# Altium project RADIAN_Power_Board_Rev2.PrjPcb
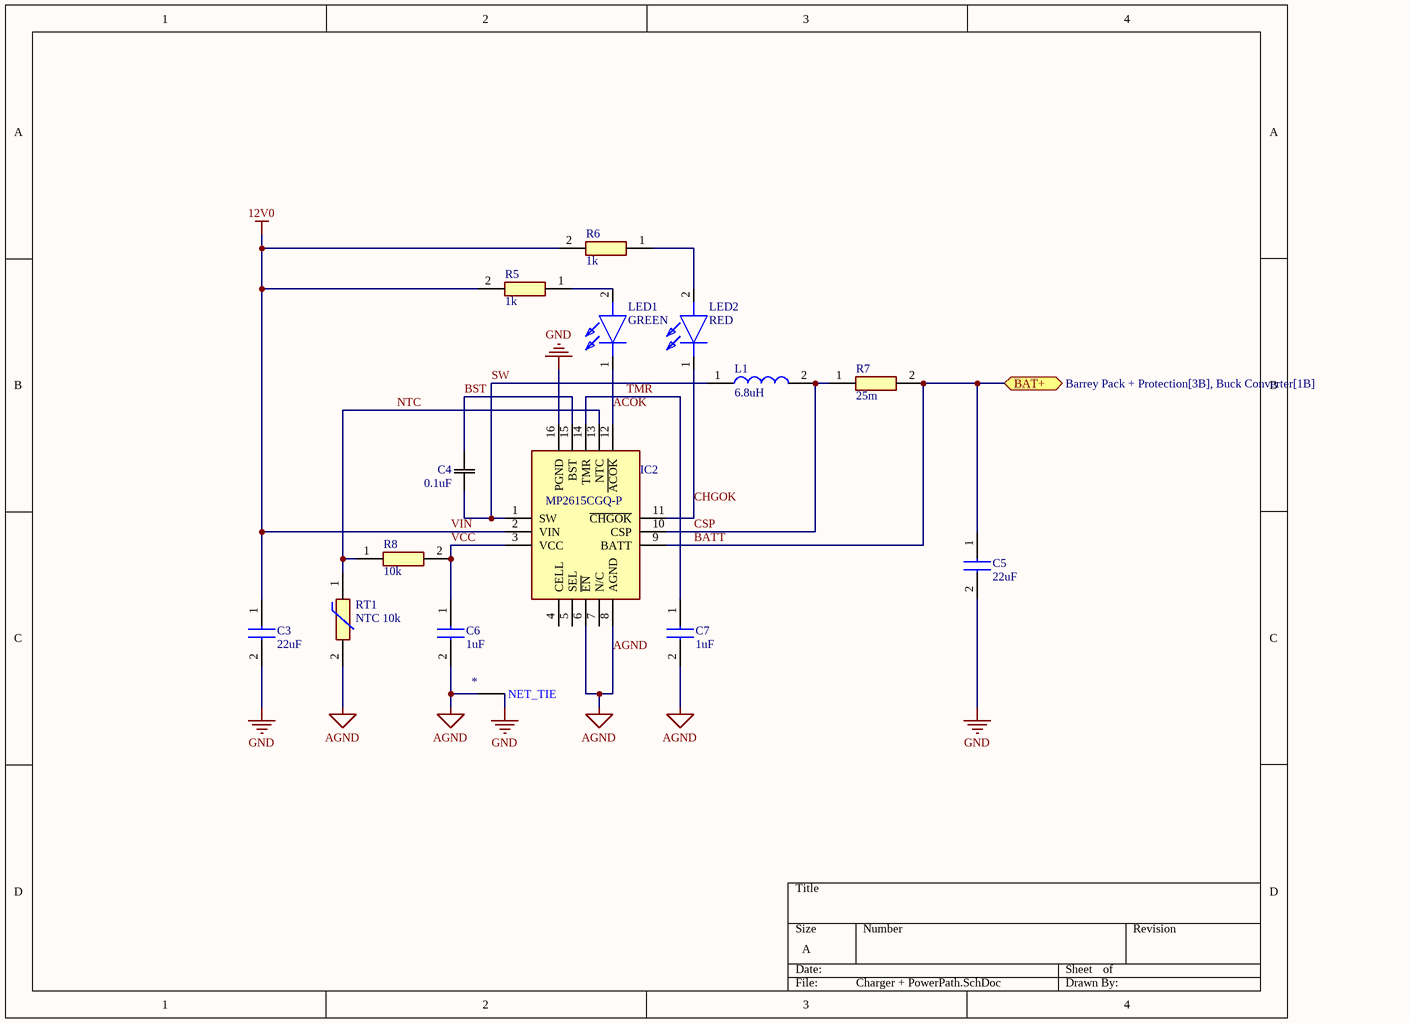
[diagram p0: Charger + PowerPath.SchDoc]
2 sheets, 30 parts. Net scope: flat (ports and power ports of the same name join across sheets).
Board file: RADIAN_Power_Board_Rev2.PcbDoc
Sheets:
  Charger + PowerPath.SchDoc
  Buck Converter.SchDoc

## Sheet Charger + PowerPath.SchDoc
size A; SheetNumber: 3; SheetTotal: 5

### Parts
*  Component_1  [NET_TIE]  (value not drawn)
C3  22uF  [C2220]
C4  0.1uF  [CAPC220145_88N_KEM]
C5  22uF  [C2220]
C6  1uF  [C0805]
C7  1uF  [C0805]
IC2  MP2615CGQ-P  [MP2615CGQP]
L1  6.8uH  [INDPM6965X300N]
LED1  GREEN  [LEDC2012X110N]
LED2  RED  [LEDC2012X120N]
R5  1k  [RESC2012X60N]
R6  1k  [RESC2012X60N]
R7  25m  [RESC6332X71N]
R8  10k  [RESC2012X60N]
RT1  NTC 10k  [THRMC2012X130N]

### Ports
BAT+ (bidir, see Barrey Pack + Protection[3B], Buck Converter[1B])

### Nets
AGND: *.N1(NET_TIE) C6.2 C7.2 IC2.6(~{EN}) IC2.8(AGND) RT1.2
GND: *.N2(NET_TIE) C3.2 C5.2 IC2.16(PGND)
VIN: C3.1 IC2.2(VIN) R5.2 R6.2  [also labelled 12V0]
ACOK: IC2.12(~{ACOK}) LED1.1(K)
BATT: C5.1 IC2.9(BATT) R7.2 ; port BAT+
BST: C4.2 IC2.15(BST)
CHGOK: IC2.11(~{CHGOK}) LED2.1(K)
CSP: IC2.10(CSP) L1.2 R7.1
NTC: IC2.13(NTC) R8.1 RT1.1
SW: C4.1 IC2.1(SW) L1.1
TMR: C7.1 IC2.14(TMR)
VCC: C6.1 IC2.3(VCC) R8.2
NetLED1_2: LED1.2(A) R5.1
NetLED2_2: LED2.2(A) R6.1

Not connected (* = marked no-connect by the designer): IC2 4(CELL) 5(SEL) 7(N/C)

### Library data of the parts
C3 C5 = C2220C226J3RACTU: Capacitor; Manufacturer_Name: KEMET; Datasheet Link: https://content.kemet.com/datasheets/KEM_C1002_X7R_SMD.pdf; Height: 2.2mm; Manufacturer_Part_Number: C2220C226J3RACTU
C4 = C0805C104K5RACTU: SMD Comm X7R, Ceramic, 0.1 uF, 10%, 50 VDC, X7R, SMD, MLCC, Temperature Stable, Class II, 0805; Manufacturer_Name: Kemet; Copyright: Copyright (C) 2025 Ultra Librarian. All rights reserved.; Manufacturer_Part_Number: C0805C104K5RACTU
C6 C7 = C0805C105J4RAC7210: Capacitor; Manufacturer_Name: KEMET; Datasheet Link: https://content.kemet.com/datasheets/KEM_C1002_X7R_SMD.pdf; Height: 1.1mm; Manufacturer_Part_Number: C0805C105J4RAC7210; Mouser Part Number: 80-C0805C105J4RACLR; Mouser Price/Stock: https://www.mouser.co.uk/ProductDetail/KEMET/C0805C105J4RAC7210?qs=7zB%252BIQS%2FKOJG%252BUtduyFhHw%3D%3D
IC2 = MP2615CGQ-P: Integrated Circuit; Manufacturer_Name: Monolithic Power Systems (MPS); Datasheet Link: https://www.monolithicpower.com/en/documentview/productdocument/index/version/2/document_type/datasheet/lang/en/sku/MP2615CGQ-Z/document_id/8689; Height: 1mm; Manufacturer_Part_Number: MP2615CGQ-P; Mouser Part Number: 946-MP2615CGQ-P; Mouser Price/Stock: https://www.mouser.co.uk/ProductDetail/Monolithic-Power-Systems-MPS/MP2615CGQ-P?qs=yqaQSyyJnNhWta3fzFvGpA%3D%3D
L1 = IHLP2525CZER6R8M11: Inductor; Manufacturer_Name: Vishay; Datasheet Link: https://componentsearchengine.com/Datasheets/1/IHLP2525CZER6R8M11.pdf; Height: 3mm; Manufacturer_Part_Number: IHLP2525CZER6R8M11; Mouser Part Number: 70-IHLP2525CZER6R8M; Mouser Price/Stock: https://www.mouser.co.uk/ProductDetail/Vishay-Dale/IHLP2525CZER6R8M11?qs=gMuw6kkpPFiGyjtgR5JvsQ%3D%3D; Arrow Part Number: IHLP2525CZER6R8M11; Arrow Price/Stock: https://www.arrow.com/en/products/ihlp2525czer6r8m11/vishay?region=nac
LED1 = LTST-C170KGKT: LED; Manufacturer_Name: Lite-On; Datasheet Link: http://uk.rs-online.com/web/p/products/6920907/?grossPrice=Y&cm_mmc=UK-PLA-DS3A-_-google-_-PLA_UK_EN_Displays_And_Optoelectronics-_-LEDs_And_LED_Accessories-_-PRODUCT+GROUP&matchtype=&gclid=Cj0KCQjw8vnMBRDgARIsACm_BhL5snkjsAk6gK-vmanqdq02kRfWctzcy3t-1Yoin; Height: 1.1mm; Manufacturer_Part_Number: LTST-C170KGKT; Mouser Part Number: 859-LTST-C170KGKT; Mouser Price/Stock: https://www.mouser.co.uk/ProductDetail/Lite-On/LTST-C170KGKT?qs=o1ACzGp%252Bek3F8d3sLmVFGg%3D%3D; Arrow Part Number: LTST-C170KGKT; Arrow Price/Stock: https://www.arrow.com/en/products/ltst-c170kgkt/lite-on-technology?utm_currency=USD&region=europe
LED2 = LTST-C170KRKT: LED; Manufacturer_Name: Lite-On; Datasheet Link: https://componentsearchengine.com/Datasheets/1/LTST-C170KRKT.pdf; Height: 1.2mm; Manufacturer_Part_Number: LTST-C170KRKT; Mouser Part Number: 859-LTST-C170KRKT; Mouser Price/Stock: https://www.mouser.co.uk/ProductDetail/LITEON/LTST-C170KRKT?qs=NUb82WqeCyrVOID%2Fxt4rgA%3D%3D; Arrow Part Number: LTST-C170KRKT; Arrow Price/Stock: https://www.arrow.com/en/products/ltst-c170krkt/lite-on-technology?utm_currency=USD&region=europe
R5 R6 = RT0805FRE071KL: Resistor; Manufacturer_Name: YAGEO; Datasheet Link: https://www.yageo.com/upload/media/product/productsearch/datasheet/rchip/PYu-RT_1-to-0.01_RoHS_L_13.pdf; Height: 0.6mm; Manufacturer_Part_Number: RT0805FRE071KL; Mouser Part Number: 603-RT0805FRE071KL; Mouser Price/Stock: https://www.mouser.co.uk/ProductDetail/YAGEO/RT0805FRE071KL?qs=8cPjvKtxWv4wlgQ3qHu8dQ%3D%3D; Arrow Part Number: RT0805FRE071KL; Arrow Price/Stock: https://www.arrow.com/en/products/rt0805fre071kl/yageo?region=nac
R7 = WSL2512R0250FEA: Resistor; Manufacturer_Name: Vishay; Manufacturer_Part_Number: WSL2512R0250FEA; Mouser Part Number: 71-WSL2512R0250FEA; Mouser Price/Stock: https://www.mouser.co.uk/ProductDetail/Vishay-Dale/WSL2512R0250FEA?qs=ViWNInbc%252BeVOvNhWssTY5g%3D%3D; Arrow Part Number: WSL2512R0250FEA; Arrow Price/Stock: https://www.arrow.com/en/products/wsl2512r0250fea/vishay?utm_currency=USD&region=nac
R8 = RT0805FRE0710KL: Resistor; Manufacturer_Name: YAGEO; Datasheet Link: https://www.yageo.com/upload/media/product/productsearch/datasheet/rchip/PYu-RT_1-to-0.01_RoHS_L_13.pdf; Height: 0.6mm; Manufacturer_Part_Number: RT0805FRE0710KL; Mouser Part Number: 603-RT0805FRE0710KL; Mouser Price/Stock: https://www.mouser.co.uk/ProductDetail/YAGEO/RT0805FRE0710KL?qs=Fz%2FrpjPuTcHcdP0eDiVtNg%3D%3D
RT1 = B57442V5103H062: Thermistor; Manufacturer_Name: TDK; Datasheet Link: https://product.tdk.com/system/files/dam/doc/product/sensor/ntc/chip-ntc-thermistor/data_sheet/50/db/ntc/ntc_smd_automotive_series_0805.pdf; Height: 1.3mm; Manufacturer_Part_Number: B57442V5103H062; Mouser Part Number: 871-B57442V5103H62; Mouser Price/Stock: https://www.mouser.com/Search/Refine.aspx?Keyword=871-B57442V5103H62; Arrow Part Number: B57442V5103H062; Arrow Price/Stock: https://www.arrow.com/en/products/b57442v5103h062/epcos-tdk

## Sheet Buck Converter.SchDoc
size A; SheetNumber: 4; SheetTotal: 5
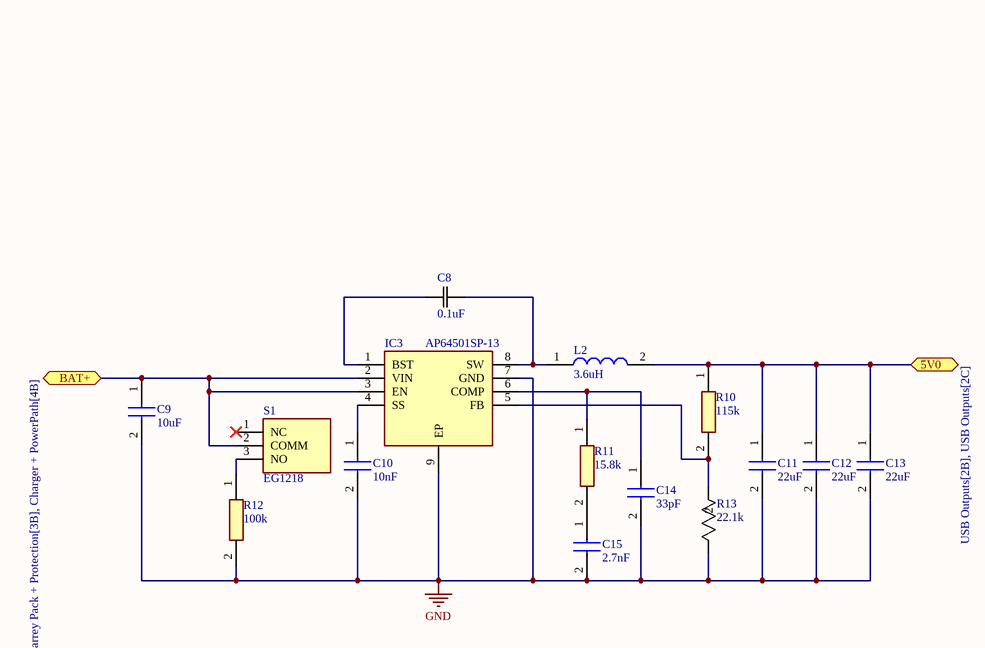
[diagram p1: Buck Converter.SchDoc]

### Parts
C8  0.1uF  [CAPC220145_88N_KEM]
C9  10uF  [CAPC3225X280N]
C10  10nF  [CAPC2012X88N]
C11  22uF  [C1210]
C12  22uF  [C1210]
C13  22uF  [C1210]
C14  33pF  [CAPC2012X70N]
C15  2.7nF  [C0805]
IC3  AP64501SP-13  [SOIC127P600X163-9N]
L2  3.6uH  [7447797360]
R10  115k  [RESC2012X60N]
R11  15.8k  [RESC2012X60N]
R12  100k  [RESC2012X60N]
R13  22.1k  [RC0805N_YAG]
S1  EG1218  [EG1218]

### Ports
5V0 (bidir, see USB Outputs[2B], USB Outputs[2C]), BAT+ (bidir, see Barrey Pack + Protection[3B], Charger + PowerPath[4B])

### Nets
GND: C9.2 C10.2 C11.2 C12.2 C13.2 C14.2 C15.2 IC3.7(GND) IC3.9(EP) R12.2 R13.1
BATT: C9.1 IC3.2(VIN) IC3.3(EN) S1.2(COMM) ; port BAT+
NetC8_1: C8.1 IC3.8(SW) L2.1
NetC8_2: C8.2 IC3.1(BST)
NetC10_1: C10.1 IC3.4(SS)
NetC11_1: C11.1 C12.1 C13.1 L2.2 R10.1 ; port 5V0
NetC14_1: C14.1 IC3.6(COMP) R11.1
NetC15_1: C15.1 R11.2
NetIC3_5: IC3.5(FB) R10.2 R13.2
NetR12_1: R12.1 S1.3(NO)

Not connected (* = marked no-connect by the designer): S1 1(NC)*

### Library data of the parts
C8 = C0805C104K5RACTU: as C4 on sheet Charger + PowerPath; Copyright: Copyright (C) 2025 Ultra Librarian. All rights reserved.; Manufacturer_Part_Number: C0805C104K5RACTU
C9 = UMJ325KB7106KMHP: Capacitor; Manufacturer_Name: TAIYO YUDEN; Datasheet Link: https://www.mouser.com/datasheet/2/396/taiyo_yuden_12132018_mlcc11_hq_e-1510082.pdf; Height: 2.8mm; Manufacturer_Part_Number: UMJ325KB7106KMHP; Mouser Part Number: 963-UMJ325KB7106KMHP; Mouser Price/Stock: https://www.mouser.co.uk/ProductDetail/TAIYO-YUDEN/UMJ325KB7106KMHP?qs=sBf%2Fb4nBSld9dXe3Wmrcww%3D%3D
C10 = C0805C103KAREC7210: Capacitor; Manufacturer_Name: KEMET; Datasheet Link: https://content.kemet.com/datasheets/KEM_C1090_X7R_ESD.pdf; Height: 0.88mm; Manufacturer_Part_Number: C0805C103KAREC7210; Mouser Part Number: 80-C0805C103KARECLR; Mouser Price/Stock: https://www.mouser.co.uk/ProductDetail/KEMET/C0805C103KAREC7210?qs=55YtniHzbhA9BJ2p2brEAA%3D%3D
C11-C13 = C1210C226K4RACTU: Capacitor; Manufacturer_Name: KEMET; Datasheet Link: https://content.kemet.com/datasheets/KEM_C1002_X7R_SMD.pdf; Manufacturer_Part_Number: C1210C226K4RACTU; Mouser Part Number: 80-C1210C226K4RACTU; Mouser Price/Stock: https://www.mouser.co.uk/ProductDetail/KEMET/C1210C226K4RACTU?qs=sxHCE4x4v6aAPDKYEWh4OQ%3D%3D; Arrow Part Number: C1210C226K4RACTU; Arrow Price/Stock: https://www.arrow.com/en/products/c1210c226k4ractu/kemet-corporation
C14 = VJ0805A330FXBPW1BC: Capacitor; Manufacturer_Name: Vishay; Datasheet Link: https://componentsearchengine.com/Datasheets/1/VJ0805A330FXBPW1BC.pdf; Height: 0.7mm; Manufacturer_Part_Number: VJ0805A330FXBPW1BC; Mouser Part Number: 77-VJ0805A330FXBPBC; Mouser Price/Stock: https://www.mouser.com/Search/Refine.aspx?Keyword=77-VJ0805A330FXBPBC
C15 = C0805C272J5GACTU: Capacitor; Manufacturer_Name: KEMET; Datasheet Link: https://content.kemet.com/datasheets/KEM_C1003_C0G_SMD.pdf; Height: 1.1mm; Manufacturer_Part_Number: C0805C272J5GACTU; Mouser Part Number: 80-C0805C272J5GACTU; Mouser Price/Stock: https://www.mouser.co.uk/ProductDetail/KEMET/C0805C272J5GACTU?qs=tQYgeJ5sXdnrALuy0kZT2Q%3D%3D
IC3 = AP64501SP-13: Integrated Circuit; Manufacturer_Name: Diodes Incorporated; Datasheet Link: https://www.diodes.com//assets/Datasheets/AP64501.pdf; Height: 1.63mm; Manufacturer_Part_Number: AP64501SP-13; Mouser Part Number: 621-AP64501SP-13; Mouser Price/Stock: https://www.mouser.co.uk/ProductDetail/Diodes-Incorporated/AP64501SP-13?qs=P1JMDcb91o7FS0GU%252BW7TIQ%3D%3D; Arrow Part Number: AP64501SP-13; Arrow Price/Stock: https://www.arrow.com/en/products/ap64501sp-13/diodes-incorporated?utm_currency=USD&region=nac
L2 = 7447797360: Inductor; Manufacturer_Name: Wurth Elektronik; Datasheet Link: https://www.we-online.com/catalog/datasheet/7447797360.pdf; Height: 6.1mm; Manufacturer_Part_Number: 7447797360; Mouser Part Number: 710-7447797360; Mouser Price/Stock: https://www.mouser.co.uk/ProductDetail/Wurth-Elektronik/7447797360?qs=2kOmHSv6VfRmQPiKFu4rqg%3D%3D
R10 = AC0805FR-07115KL: Resistor; Manufacturer_Name: KEMET; Datasheet Link: https://www.yageo.com/upload/media/product/productsearch/datasheet/rchip/PYu-AC_51_RoHS_L_8.pdf; Height: 0.6mm; Manufacturer_Part_Number: AC0805FR-07115KL; Mouser Part Number: 603-AC0805FR-07115KL; Mouser Price/Stock: https://www.mouser.co.uk/ProductDetail/Yageo/AC0805FR-07115KL?qs=UBLIud9aIG1IFcDwGFdMOw%3D%3D
R11 = RC0805FR-0715K8L: Resistor; Manufacturer_Name: KEMET; Datasheet Link: http://www.yageo.com/documents/recent/PYu-RC_Group_51_RoHS_L_10.pdf; Height: 0.6mm; Manufacturer_Part_Number: RC0805FR-0715K8L; Mouser Part Number: 603-RC0805FR-0715K8L; Mouser Price/Stock: https://www.mouser.co.uk/ProductDetail/Yageo/RC0805FR-0715K8L/?qs=I9s6%2Fg9G0vu77HcX9Y4n3w%3D%3D; Arrow Part Number: RC0805FR-0715K8L; Arrow Price/Stock: https://www.arrow.com/en/products/rc0805fr-0715k8l/yageo
R12 = CHV0805-FX-1003ELF: Resistor; Manufacturer_Name: Bourns; Datasheet Link: https://www.bourns.com/docs/product-datasheets/chv.pdf; Height: 0.6mm; Manufacturer_Part_Number: CHV0805-FX-1003ELF; Arrow Part Number: CHV0805-FX-1003ELF; Arrow Price/Stock: https://www.arrow.com/en/products/chv0805-fx-1003elf/bourns
R13 = RC0805FR-0722K1L: Description; Manufacturer_Name: Yageo; Copyright: Copyright (C) 2025 Ultra Librarian. All rights reserved.; Manufacturer_Part_Number: RC0805FR-0722K1L
S1 = EG1218: Switch; Manufacturer_Name: E-Switch; Datasheet Link: https://configured-product-images.s3.amazonaws.com/2D/specs/EG1218.pdf; Height: 7.4mm; Manufacturer_Part_Number: EG1218; Mouser Part Number: 612-EG1218; Mouser Price/Stock: https://www.mouser.co.uk/ProductDetail/E-Switch/EG1218?qs=xDsBkp9LkocT0c8K%252B5e%2FgA%3D%3D

## Nets that join several sheets
GND: Charger + PowerPath (*.N2 C3.2 C5.2 IC2.16), Buck Converter (11 pins)
BATT: Charger + PowerPath (C5.1 IC2.9 R7.2), Buck Converter (C9.1 IC3.2 IC3.3 S1.2)